# Altium schematic sheet TMPT_LTC_1.SchDoc
size A4; SheetNumber: 10; SheetTotal: 10
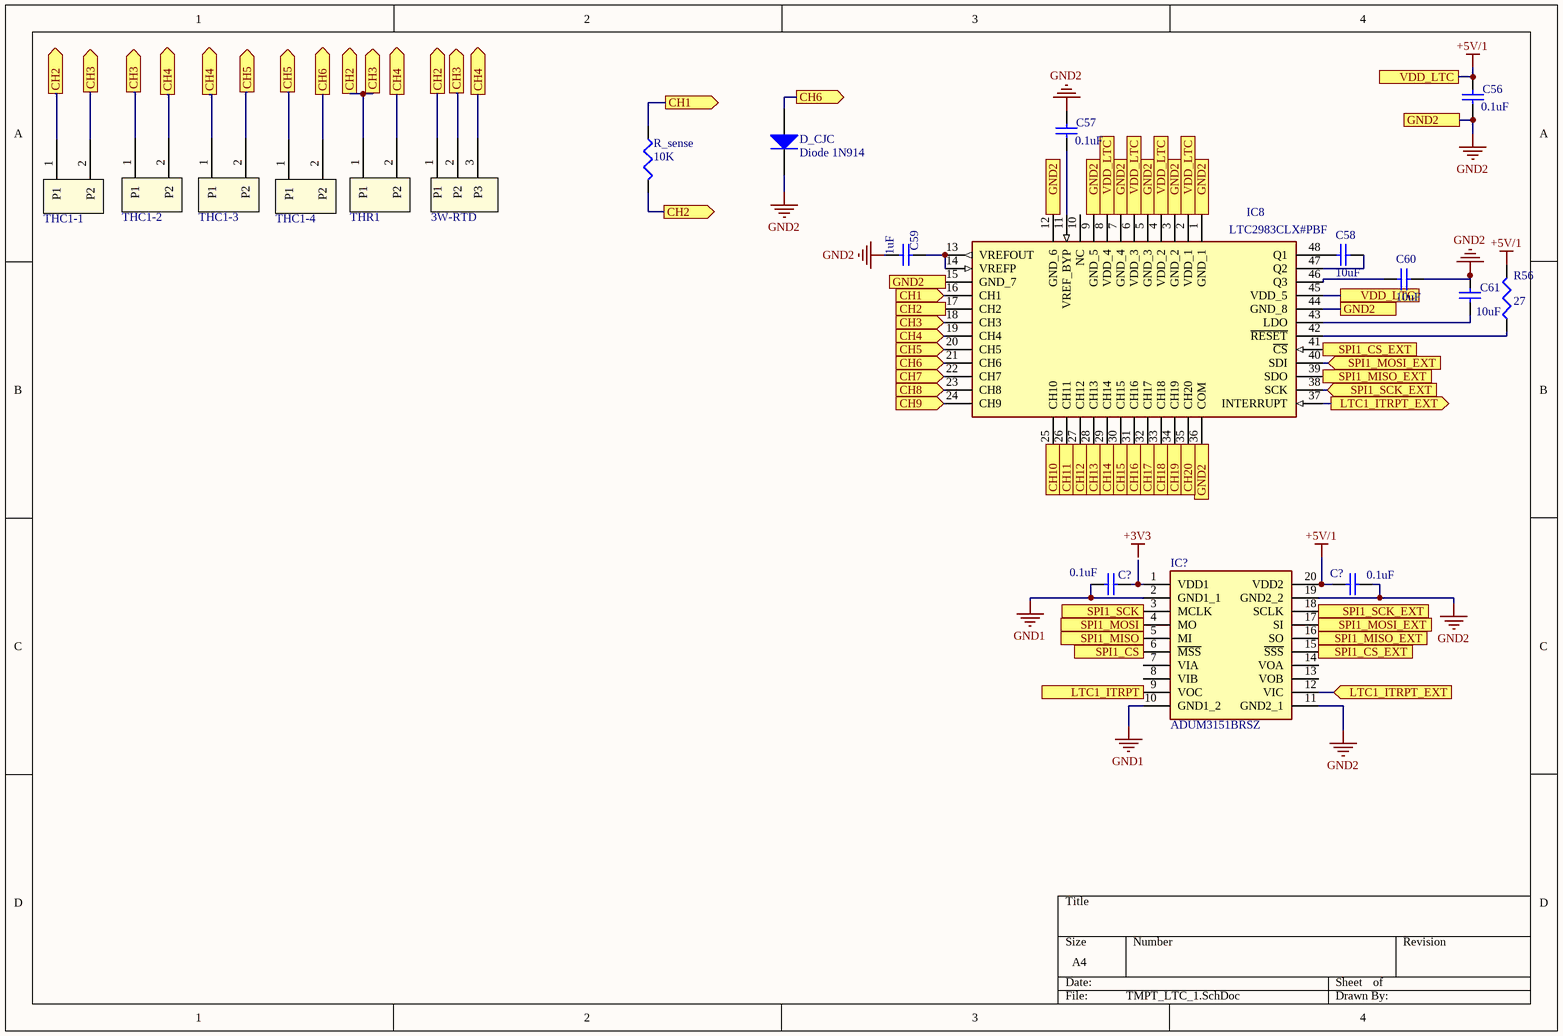
[diagram p0: TMPT_LTC_1.SchDoc]

## Parts
(Parts that share a designator on the sheet are numbered #1, #2 ... from top to bottom, then left to right.)
3W-RTD  PCC-SMD-1000-3  [PCC-SMD-1000-3]  (value not drawn)
C56  value 0.1uF  [1608[0603]]  (hidden comment: Cap Semi)
C57  value 0.1uF  [1608[0603]]  (hidden comment: Cap Semi)
C58  value 10uF  [C1206]  (hidden comment: X7R)
C59  value 1uF  [1608[0603]]  (hidden comment: Cap Semi)
C60  value 10uF  [1608[0603]]  (hidden comment: X5R)
C61  value 10uF  [1608[0603]]  (hidden comment: Cap Semi)
C?#1  value 0.1uF  [C1206]  (hidden comment: X7R)
C?#2  value 0.1uF  [C1206]  (hidden comment: X7R)
D_CJC  Diode 1N914  [DO-35]
IC8  LTC2983CLX#PBF  [QFP50P900X900X160-48N]
IC?  ADUM3151BRSZ  [SOP65P780X200-20N]
R56  value 27  [J1-0603]  (hidden comment: Res3)
R_sense  value 10K  [J1-0603]  (hidden comment: Res3)
THC1-1  PCC-SMD-1000-2  [PCC-SMD-1000]  (value not drawn)
THC1-2  PCC-SMD-1000-2  [PCC-SMD-1000]  (value not drawn)
THC1-3  PCC-SMD-1000-2  [PCC-SMD-1000]  (value not drawn)
THC1-4  PCC-SMD-1000-2  [PCC-SMD-1000]  (value not drawn)
THR1  PCC-SMD-1000-2  [PCC-SMD-1000]  (value not drawn)

## Ports
CH1 (in), CH1 (out), CH2 (in), CH2 (out), CH3 (in), CH3 (out), CH4 (in), CH4 (out), CH5 (in), CH5 (out), CH6 (in), CH6 (out), CH7 (in), CH8 (in), CH9 (in), CH10 (in), CH11 (in), CH12 (in), CH13 (in), CH14 (in), CH15 (in), CH16 (in), CH17 (in), CH18 (in), CH19 (in), CH20 (in), GND2, LTC1_ITRPT (out), LTC1_ITRPT_EXT (in), LTC1_ITRPT_EXT (out), SPI1_CS (in), SPI1_CS_EXT (in), SPI1_CS_EXT (out), SPI1_MISO (out), SPI1_MISO_EXT (in), SPI1_MISO_EXT (out), SPI1_MOSI (in), SPI1_MOSI_EXT (in), SPI1_MOSI_EXT (out), SPI1_SCK (in), SPI1_SCK_EXT (in), SPI1_SCK_EXT (out), VDD_LTC

## Nets
+5V/1: C56.2 C?#2.2 IC8.2(VDD_1) IC8.4(VDD_2) IC8.6(VDD_3) IC8.8(VDD_4) IC8.45(VDD_5) IC?.20(VDD2) R56.2 ; port VDD_LTC
GND1: C?#1.2 IC?.2(GND1_1) IC?.10(GND1_2)
GND2: C56.1 C57.2 C59.2 C60.1 C61.2 C?#2.1 D_CJC.2(K) IC8.1(GND_1) IC8.3(GND_2) IC8.5(GND_3) IC8.7(GND_4) IC8.9(GND_5) IC8.12(GND_6) IC8.15(GND_7) IC8.36(COM) IC8.44(GND_8) IC?.11(GND2_1) IC?.19(GND2_2) ; port GND2
CH1: IC8.16(CH1) R_sense.1 ; port CH1
CH2: 3W-RTD.1(P1) 3W-RTD.2(P2) IC8.17(CH2) IC8.18(CH3) R_sense.2 THC1-1.1(P1) THC1-1.2(P2) THC1-2.1(P1) THR1.1(P1) ; port CH2, port CH3
CH4: 3W-RTD.3(P3) IC8.19(CH4) THC1-2.2(P2) THC1-3.1(P1) THR1.2(P2) ; port CH4
CH5: IC8.20(CH5) THC1-3.2(P2) THC1-4.1(P1) ; port CH5
CH6: D_CJC.1(A) IC8.21(CH6) THC1-4.2(P2) ; port CH6
CH7: IC8.22(CH7) ; port CH7
CH8: IC8.23(CH8) ; port CH8
CH9: IC8.24(CH9) ; port CH9
CH10: IC8.25(CH10) ; port CH10
CH11: IC8.26(CH11) ; port CH11
CH12: IC8.27(CH12) ; port CH12
CH13: IC8.28(CH13) ; port CH13
CH14: IC8.29(CH14) ; port CH14
CH15: IC8.30(CH15) ; port CH15
CH16: IC8.31(CH16) ; port CH16
CH17: IC8.32(CH17) ; port CH17
CH18: IC8.33(CH18) ; port CH18
CH19: IC8.34(CH19) ; port CH19
CH20: IC8.35(CH20) ; port CH20
LTC1_ITRPT: IC?.9(VOC) ; port LTC1_ITRPT
LTC1_ITRPT_EXT: IC8.37(INTERRUPT) IC?.12(VIC) ; port LTC1_ITRPT_EXT
SPI1_CS: IC?.6(~{MSS}) ; port SPI1_CS
SPI1_CS_EXT: IC8.41(~{CS}) IC?.15(~{SSS}) ; port SPI1_CS_EXT
SPI1_MISO: IC?.5(MI) ; port SPI1_MISO
SPI1_MISO_EXT: IC8.39(SDO) IC?.16(SO) ; port SPI1_MISO_EXT
SPI1_MOSI: IC?.4(MO) ; port SPI1_MOSI
SPI1_MOSI_EXT: IC8.40(SDI) IC?.17(SI) ; port SPI1_MOSI_EXT
SPI1_SCK: IC?.3(MCLK) ; port SPI1_SCK
SPI1_SCK_EXT: IC8.38(SCK) IC?.18(SCLK) ; port SPI1_SCK_EXT
NetC57_1: C57.1 IC8.11(VREF_BYP)
NetC58_1: C58.1 IC8.47(Q2)
NetC58_2: C58.2 IC8.48(Q1)
NetC59_1: C59.1 IC8.13(VREFOUT) IC8.14(VREFP)
NetC60_2: C60.2 IC8.46(Q3)
NetC61_1: C61.1 IC8.43(LDO)
NetC?#1_1: C?#1.1 IC?.1(VDD1)
NetIC8_42: IC8.42(~{RESET}) R56.1

Not connected (* = marked no-connect by the designer): IC8 10(NC); IC? 7(VIA) 8(VIB) 13(VOB) 14(VOA)

## Notes on the sheet
- Labels drawn without touching a wire or pin: +3V3

## Library data of the parts
3W-RTD = PCC-SMD-1000-3: Circuit Board Thermocouple, RTD, Thermistor Connectors For Miniature Connectors
C56-C61 C?#1 C?#2 = Cap Semi: Capacitor (Semiconductor SIM Model); Published: 8-Jun-2000; LatestRevisionDate: 29-May-2009; LatestRevisionNote: IPC-7351 Footprint Added.; PackageReference: C1206; Publisher: Altium Limited; PackageDescription: Chip Capacitor
D_CJC = Diode 1N914: High Conductance Fast Diode, Cold Juntion Compensation Diode; Published: 8-Jun-2000; LatestRevisionDate: 17-Jul-2002; LatestRevisionNote: Re-released for DXP Platform.; DatasheetVersion: 1997; PackageReference: DO-35; Publisher: Altium Limited; PackageDescription: Diode, Axial; Body 3.8 x 1.9 mm (LxDia. max), Lead Dia. 0.53 mm (max); Code_JEDEC: DO-204-AH; ComponentLink1Description: Manufacturer Link; ComponentLink1URL: http://www.fairchildsemi.com/; ComponentLink2Description: Datasheet; ComponentLink2URL: http://www.fairchildsemi.com/ds/1N%2F1N4448.pdf
IC8 = LTC2983CLX#PBF: Integrated Circuit; Manufacturer_Name: Linear Technology; Datasheet Link: http://cds.linear.com/docs/en/datasheet/2983fc.pdf; Height: 1.6mm; Manufacturer_Part_Number: LTC2983CLX#PBF; Mouser Part Number: 584-LTC2983CLX#PBF; Mouser Price/Stock: https://www.mouser.co.uk/ProductDetail/Analog-Devices-Linear-Technology/LTC2983CLXPBF?qs=hVkxg5c3xu8Vsoy0K2bp%252Bw%3D%3D; Arrow Part Number: LTC2983CLX#PBF; Arrow Price/Stock: https://www.arrow.com/en/products/ltc2983clxpbf/linear-technology
IC? = ADUM3151BRSZ: Integrated Circuit; Manufacturer_Name: Analog Devices; Datasheet Link: https://www.mouser.com/ds/2/609/ADuM3151_3152_3153-879058.pdf; Height: 2mm; Manufacturer_Part_Number: ADUM3151BRSZ; Mouser Part Number: 584-ADUM3151BRSZ; Mouser Price/Stock: https://www.mouser.co.uk/ProductDetail/Analog-Devices/ADUM3151BRSZ/?qs=hpwIUhX6lWzP%2FeQf8%252BDxeA%3D%3D; Arrow Part Number: ADUM3151BRSZ; Arrow Price/Stock: https://www.arrow.com/en/products/adum3151brsz/analog-devices
R56 R_sense = Res3: Resistor; Published: 8-Jun-2000; LatestRevisionDate: 29-May-2009; LatestRevisionNote: IPC-7351 Footprint Added.; PackageReference: J1-0603; Publisher: Altium Limited; PackageDescription: Chip Resistor
THC1-1-THC1-4 THR1 = PCC-SMD-1000-2: Circuit Board Thermocouple, RTD, Thermistor Connectors For Miniature Connectors